# Altium schematic sheet Sheet2.SchDoc
size B; DocumentNumber: 1669-1759-T001; Revision: A; SheetNumber: 2; SheetTotal: 2
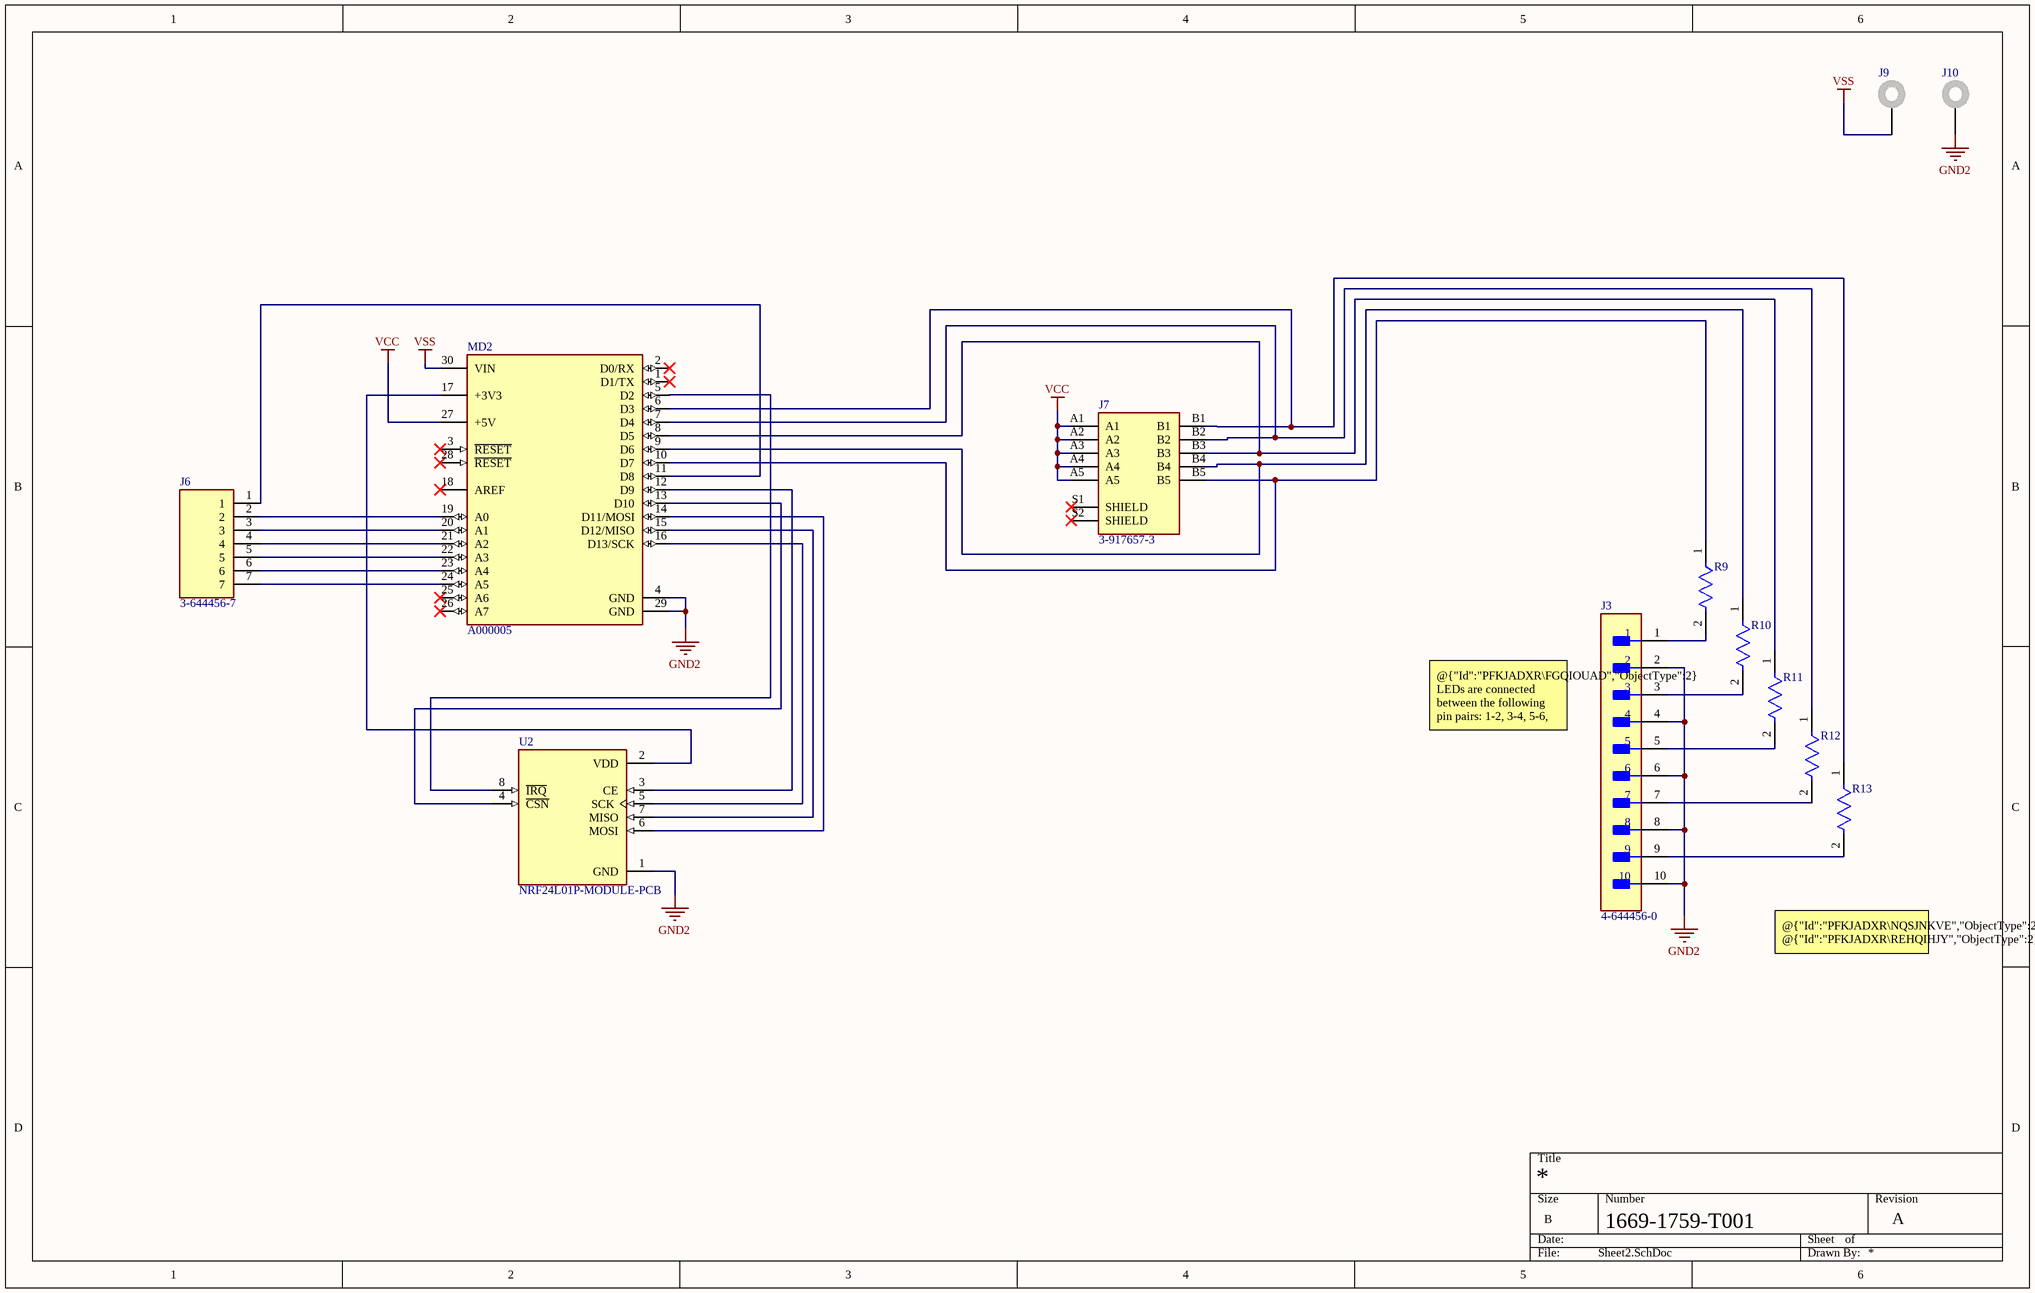
[diagram p0: Sheet2.SchDoc]

## Parts
J3  4-644456-0  [FP-4-644456-0-MFG]
J6  3-644456-7  [TE_3-644456-7]
J7  3-917657-3  [TE_3-917657-3]
J9  575-8  [KSTN-575-8]  (value not drawn)
J10  575-8  [KSTN-575-8]  (value not drawn)
MD2  A000005  [FP-A000005-MFG]
R9  CRGCQ1206J330R  [FP-CRGCQ1206-IPC_C]  (value not drawn)
R10  CRGCQ1206J330R  [FP-CRGCQ1206-IPC_C]  (value not drawn)
R11  CRGCQ1206J330R  [FP-CRGCQ1206-IPC_C]  (value not drawn)
R12  CRGCQ1206J330R  [FP-CRGCQ1206-IPC_C]  (value not drawn)
R13  CRGCQ1206J330R  [FP-CRGCQ1206-IPC_C]  (value not drawn)
U2  NRF24L01P-MODULE-PCB  [XCVR_NRF24L01P-MODULE-PCB]

## Nets
GND2: J3.2 J3.4 J3.6 J3.8 J3.10 J10.1 MD2.4(GND) MD2.29(GND) U2.1(GND)
VCC: J7.A1 J7.A2 J7.A3 J7.A4 J7.A5 MD2.27(+5V)
VSS: J9.1 MD2.30(VIN)
NetJ3_1: J3.1 R9.2
NetJ3_3: J3.3 R10.2
NetJ3_5: J3.5 R11.2
NetJ3_7: J3.7 R12.2
NetJ3_9: J3.9 R13.2
NetJ6_1: J6.1 MD2.11(D8)
NetJ6_2: J6.2 MD2.19(A0)
NetJ6_3: J6.3 MD2.20(A1)
NetJ6_4: J6.4 MD2.21(A2)
NetJ6_5: J6.5 MD2.22(A3)
NetJ6_6: J6.6 MD2.23(A4)
NetJ6_7: J6.7 MD2.24(A5)
NetJ7_B1: J7.B1 MD2.6(D3) R13.1
NetJ7_B2: J7.B2 MD2.7(D4) R12.1
NetJ7_B3: J7.B3 MD2.8(D5) R11.1
NetJ7_B4: J7.B4 MD2.9(D6) R10.1
NetJ7_B5: J7.B5 MD2.10(D7) R9.1
NetMD2_5: MD2.5(D2) U2.8(~{IRQ})
NetMD2_12: MD2.12(D9) U2.3(CE)
NetMD2_13: MD2.13(D10) U2.4(~{CSN})
NetMD2_14: MD2.14(D11/MOSI) U2.6(MOSI)
NetMD2_15: MD2.15(D12/MISO) U2.7(MISO)
NetMD2_16: MD2.16(D13/SCK) U2.5(SCK)
NetMD2_17: MD2.17(+3V3) U2.2(VDD)

Not connected (* = marked no-connect by the designer): J7 S1(SHIELD)* S2(SHIELD)*; MD2 1(D1/TX)* 2(D0/RX)* 3(~{RESET})* 18(AREF)* 25(A6)* 26(A7)* 28(~{RESET})*

## Notes on the sheet
- @{"Id":"PFKJADXR\FGQIOUAD","ObjectType":2} LEDs are connected between the following pin pairs: 1-2, 3-4, 5-6, 7-8, 9-10.
- @{"Id":"PFKJADXR\NQSJNKVE","ObjectType":2} @{"Id":"PFKJADXR\REHQIHJY","ObjectType":2} @{"Id":"PFKJADXR\ZYVDQRQZ","ObjectType":2} @{"Id":"PFKJADXR\NCDOSIKG","ObjectType":2} @{"Id":"PFKJADXR\DLTFFKSW","ObjectType":2} Resistors all 330 Ohm

## Library data of the parts
J3 = CMP-015-000000-2: Conn Unshrouded Header HDR 10 POS 2.54mm Solder ST Top Entry Thru-Hole Bag/Box; Plating: Tin; Contact Retention: No (Without); Operating Supply Voltage: 250V; Current Rating: 5A; PCB Thickness: 0.063inch; Approvals: CSA; Tail Length: 0.11inch; PCB Mount Retention: Without; Number of Positions: 10; Connector Type: Plug,Header,Pin; Plating Thickness: 1.27um; Circuit Application: Signal; Contact Style: Straight; Connector System: Wire-to-Board; PCB Mounting Orientation: Vertical; Underplate Material: Nickel; Gender: Male; Contact Resistance: 6mR; Component Type: Standard; Contact Plating: Tin,Matte; Availability: Unavailable; Radiation Hardening: No; Voltage Rating (AC): 250V; Orientation: Straight; Backwall/Post Interruptions: No (Without); Source: 4-644456-0.SchLib; Flammability Rating: UL94 V-0; Contact Shape: Square; MP: 4-644456-0; Shrouded: No (Without); Number of Rows: 1; Contact Material: Copper Alloy; Series: MTA-100; Strain Relief: No (Without); Termination: Solder; Mounting Technology: Through Hole; Contact Gender: Male; Max Operating Temperature: 221°C; Voltage Rating: 250V; RoHS Compliant: Yes; Package: None; Depth: 2.33mm; Color: Natural; Design Item ID: 4-644456-0; Packaging: Bag; Mating Retention: No (Without); Contact Current Rating: 5A; Pin Count: 10; Pitch: 2.54mm; Housing Color: Natural; Height: 10.03mm; Package Quantity: 500; Length: 25.1mm; Mating Alignment: No (Without); Lead Free: Lead Free; ELV: Compliant; Min Operating Temperature: -67°C; Price: None; Contact Mating Length: 7.49mm; Contact Type: Male Pin; PCB Mount Alignment: No (Without); Number of Contacts: 10; Value: *; Housing Material: Polyester; Max Voltage Rating (AC): 250V; Sealable: No (Without)
J6 = CMP-002-00071-2: Header; 0.1 in. (Centerline); White (Housing); Polyester; 7; UL 94V-0; Gender: Male; Connector Type: Plug,Header,Pin; MF: TE Connectivity; Voltage Rating: 250V; Mouser-Purchase-URL: https://snapeda.com/shop?store=Mouser&id=554533; Mounting Technology: Through Hole; Value: *; Source: 3-644456-7.SchLib; Max Operating Temperature: 221°C; Digi-Key_Part_Number: A31117-ND; DigiKey-Purchase-URL: https://snapeda.com/shop?store=DigiKey&id=554533; Pins: 7; Min Operating Temperature: -67°C; Component Type: Standard; SnapEDA_Link: https://www.snapeda.com/parts/3-644456-7/TE%20Connectivity%20AMP%20Connectors/view-part/554533/?ref=snap; Case/Package: None; Design Item ID: 3-644456-7; RoHS Compliant: Yes; EU_RoHS_Compliance: Compliant; MP: 3-644456-7
J7 = CMP-007-000000-1: Source: 3-917657-3.SchLib; Package: None; Price: None; Design Item ID: 3-917657-3; Value: *; MP: 3-917657-3; Pin Count: 12; Availability: Unavailable; Component Type: Standard
J9 J10 = CMP-1672-00007-5: Non-Insulated Jack, Through Hole, RoHS, Bulk; Manufacturer: Keystone; PackageDescription: 1-Pin Through Hole Device, Dia 7.92 mm; PackageReference: 575-8; ComponentLink1Description: Manufacturer URL; Mounting Technology: Through Hole; ComponentLink2URL: http://www.keyelco.com/product-pdf.cfm?p=2379; ComponentLink2Description: Datasheet; DatasheetVersion: Rev. B, 11/1994; ComponentLink1URL: http://www.keyelco.com/
MD2 = CMP-189986-000002-1: ARDUINO NANO ATMEGA328 EVAL BRD; Number of Bits: 8; Evaluation Kit: Yes; Operating Supply Voltage: 12V; Interface: I2C; Data Bus Width: 8b; Core Architecture: AVR; Packaging: Bulk; Length: 7inch; Package Quantity: 50; Width: 5inch; REACH SVHC: No SVHC; Weight: 0.358383oz; Series: AVR® ATmega; Height: 0.25inch
R9-R13 = CMP-03211-006050-1: CRGCQ1206 330Ω 0.25W 5% ±100ppm/°C 200V; Manufacturer: TE Connectivity; Tolerance: 0.05; Automotive Grade: Grade 572; Ambient Temperature Range High: +70°C; ComponentLink2Description: Datasheet; Series: CRGCQ; Device Class L1: Passive Components; Voltage Rating: 200V; Temperature Coefficient: ±100ppm/°C; Composition: Thick Film; Category: Res; ComponentLink2URL: https://www.te.com/commerce/DocumentDelivery/DDEController?Action=showdoc&DocId=Data+Sheet%7F1773204-3%7F1%7Fpdf%7FEnglish%7FENG_DS_1773204-3_1.pdf%7F4-2176347-581; Power Rating: 0.25W; Temperature: -55°C to +155°C; Ipc Land Pattern Name: RESC310155X55; Height: 0.65mm; Value: 330Ω; Resistance: 330Ω; Lead Free: Yes; Manufacturer Part Number: CRGCQ1206J330R; Device Class L3: Chip SMD Resistors; Device Class L2: Resistors; Package: CRGCQ1206; Temperature Range High: +155°C; Temperature Range Low: -55°C; Automotive: Yes; RoHS: TRUE; Octopart: https://octopart.com/crgcq1206j330r-te+connectivity-91018326
U2 = CMP-005-000000-1: - Transceiver For Use With nRF24L01+; MF: Nordic Semiconductor; Component Type: Standard; Pin Count: 8; Source: NRF24L01P-MODULE-PCB.SchLib; Value: *; Design Item ID: NRF24L01P-MODULE-PCB; Mouser-Purchase-URL: https://snapeda.com/shop?store=Mouser&id=230534; Availability: Bad; Package: None; Price: None; SnapEDA_Link: https://www.snapeda.com/parts/NRF24L01P-MODULE-PCB/Nordic%20Semiconductor%20ASA/view-part/230534/?ref=snap; MP: NRF24L01P-MODULE-PCB